# Altium project in3ator.PrjPcb
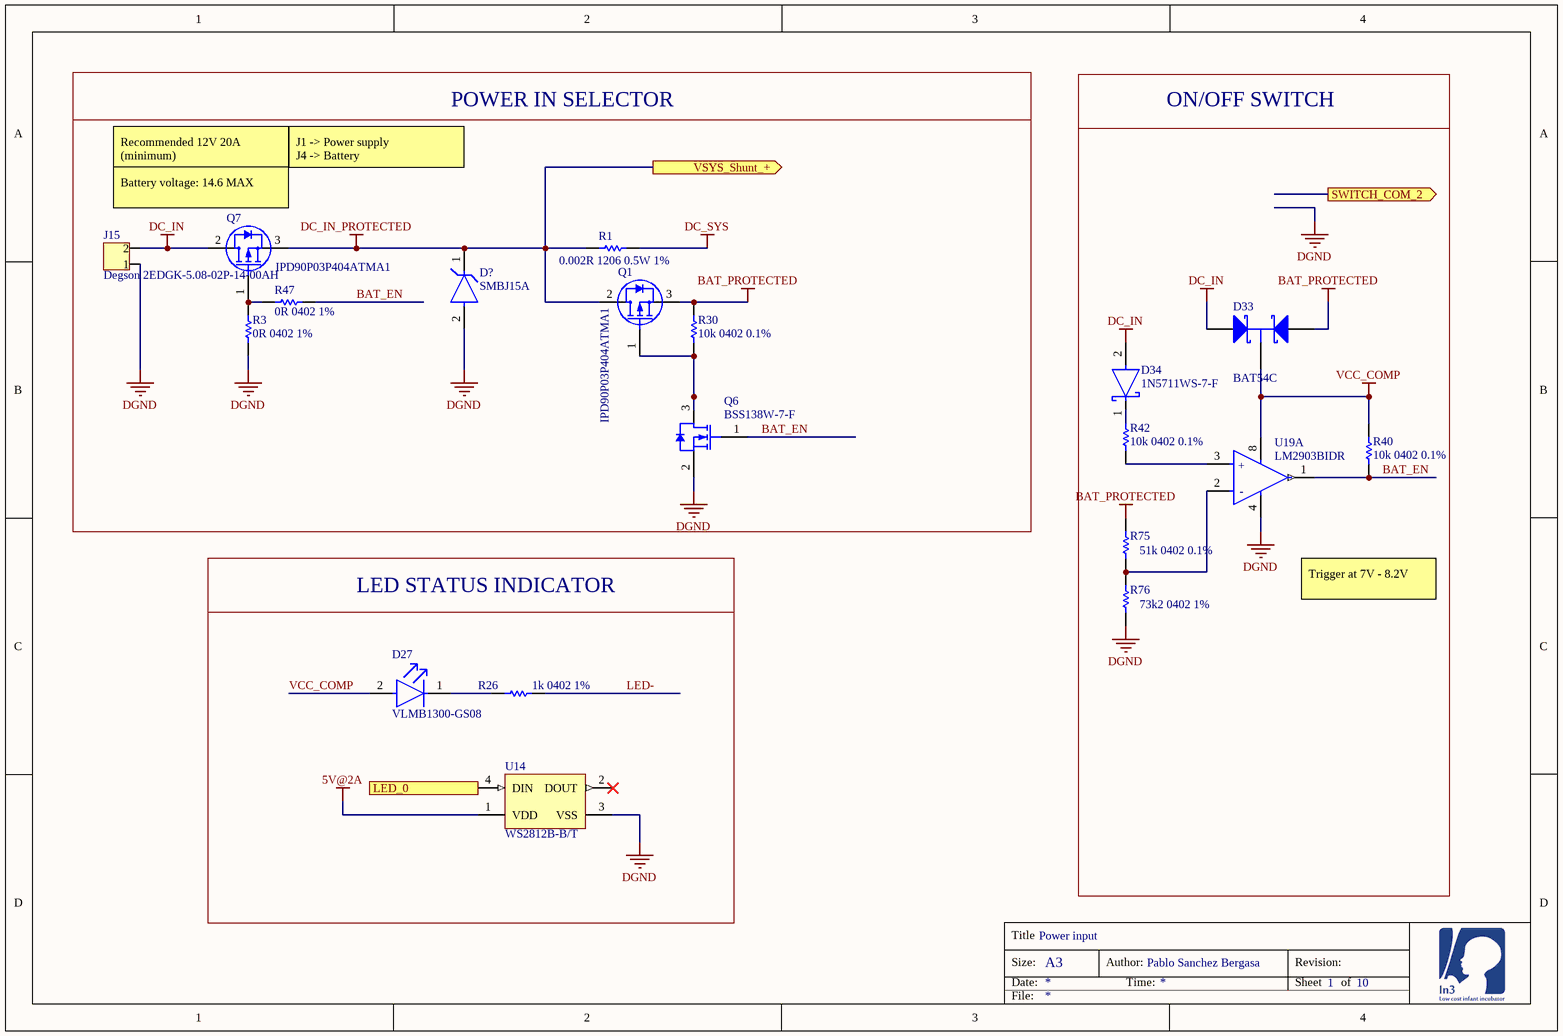
[diagram p0: Power_Input.SchDoc]
Author_in3: Pablo Sanchez Bergasa; SheetTotal_in3: 10
4 sheets, 92 parts. Net scope: flat (ports and power ports of the same name join across sheets).
Board file: Motherboard.PcbDoc
Sheets:
  Power_Input.SchDoc
  Battery.SchDoc
  Actuators.SchDoc
  Buzzer.SchDoc

## Sheet Power_Input.SchDoc: Power input
size A4; SheetNumber: 1; SheetTotal: 10

### Parts
D27  VLMB1300-GS08  [FP-6_541-5094_01-4-MFG]
D33  BAT54C  [NXP-SOT23-3_V]
D34  1N5711WS-7-F  [FP-SOD323-MFG]
D?  SMBJ15A  [FP-SMBJ-MFG]
J15  Degson 2EDGK-5.08-02P-14-00AH  [PCB-h4cyb3wxd4gf7j132tzl-1]
Q1  IPD90P03P404ATMA1  [DPAK IPD90P03P404ATMA1]
Q6  BSS138W-7-F  [DIOD-SOT323-3_V]
Q7  IPD90P03P404ATMA1  [DPAK IPD90P03P404ATMA1]
R1  0.002R 1206 0.5W 1%  [CAPC3216X180X55ML20T25]
R3  0R 0402 1%  [RESC1005X40X25ML05T10]
R26  1k 0402 1%  [RESC1005X40X25ML05T10]
R30  10k 0402 0.1%  [RESC1005X40X25ML05T10]
R40  10k 0402 0.1%  [RESC1005X40X25ML05T10]
R42  10k 0402 0.1%  [RESC1005X40X25ML05T10]
R47  0R 0402 1%  [RESC1005X40X25ML05T10]
R75  51k 0402 0.1%  [RESC1005X40X25ML05T10]
R76  73k2 0402 1%  [RESC1005X40X25ML05T10]
U14  WS2812B-B/T  [ADA-RGB-1655_V]
U19  LM2903BIDR  [FP-D0008A-MFG]  (part A of 2)

### Blocks framed on the sheet
POWER IN SELECTOR: D? J15 Q1 Q6 Q7 R1 R3 R30 R47
ON/OFF SWITCH: D33 D34 R40 R42 R75 R76 U19
LED STATUS INDICATOR: D27 R26 U14

### Ports
LED_0 (out), SWITCH_COM_2 (out), VSYS_Shunt_+ (out)

### Nets
5V@2A: U14.1(VDD)
BAT_PROTECTED: D33.2(A) Q1.3(S) R30.1 R75.2  [project net BAT_P]
DC_IN: D33.1(A) D34.2(A) J15.2 Q7.2(D)
DC_IN_PROTECTED: D?.1(C) Q1.2(D) Q7.3(S) R1.2 ; port VSYS_Shunt_+
DC_SYS: R1.1
DGND: D?.2(A) J15.1 Q6.2(S) R3.2 R76.1 U14.3(VSS) U19.4(GND)
VCC_COMP: D27.2(A) D33.3(K) R40.1 U19.8(VCC)
BAT_EN: Q6.1(G) R40.2 R47.2 U19.1(1OUT)
LED-: R26.1
NetD27_1: D27.1(C) R26.2
NetD34_1: D34.1(C) R42.2
NetQ1_1: Q1.1(G) Q6.3(D) R30.2
NetQ7_1: Q7.1(G) R3.1 R47.1
NetR42_1: R42.1 U19.3(1IN+)
NetR75_1: R75.1 R76.2 U19.2(1IN-)
NetU14_4: U14.4(DIN) ; port LED_0

Not connected (* = marked no-connect by the designer): U14 2(DOUT)*

### Notes on the sheet
- Recommended 12V 20A (minimum)
- J1 -> Power supply
  J4 -> Battery
- Battery voltage: 14.6 MAX
- Trigger at 7V - 8.2V
- Title
- Size:
- Date:
- A3
- Author:
- Time:
- Revision:
- Sheet
- of
- File:
- (in symbol CMP-04896-000007-1, part A) +; -

### Library data of the parts
D27 = CMP-02520-000013-1: LED BLUE 0603 SMD; Manufacturer: Vishay Semiconductor Opto Division; Forward Current: 20mA; Wavelength: 475nm; Viewing Angle: 130°; Forward Voltage: 3.8V; Power Dissipation: 76mW; Luminous Intensity: 28-180mcd; Led Orientation: Top View; Peak Emmision Wavelength: 468nm; RoHS: TRUE; ComponentLink2URL: http://www.vishay.com/docs/82437/vlmo1300.pdf; Ambient Temperature Range Low: -20°C; ComponentLink2Description: Datasheet; Mouser Description: LED; SMD; 0603; blue; 28-180mcd; 1.6x0.8x0.8mm; 130°; 2.8÷3.8V; 20mA; Manufacturer Part Number: VLMB1300-GS08; Package: 6.541-5094.01-4; Device Class L3: unset; Automotive: No; Temperature: -20°C to +80°C; Colour: Blue; Digikey Description: LED BLUE 0603 SMD; Device Class L2: LEDs; Temperature Range Low: -20°C; Lead Free: Yes; Category: Diode; Device Class L1: Optoelectronics; Height: 1mm; Octopart: https://octopart.com/vlmb1300-gs08-vishay-22022408; Temperature Range High: +80°C; Ambient Temperature Range High: +80°C; LCSC_PN: C435849
D33 = CMP-0417-00003-1: Schottky Barrier Diode, 30 V, 2 uA, -55 to 150 degC, 3-Pin SOT23, RoHS, Tape and Reel; Manufacturer: NXP Semiconductors; IR (uA): 2; VF (mV): 800; Trr (ns): 5; Cd (pF): 10; VR (V): 30; Rth(j-a) (K/W): 500; RoHS: TRUE; Packing: Tape and Reel; ComponentLink2URL: http://www.nxp.com/documents/data_sheet/BAT54_SER.pdf; PartNumber: BAT54C; ComponentLink2Description: Datasheet; Temperature Range: -55 to 150 degC; PackageReference: SOT23-3; PackageDescription: 3-Pin Plastic Surface-mounted Package, Body 1.3 x 2.9 mm, Pitch 0.95 mm; Mounting Technology: Surface Mount; ComponentLink1URL: http://www.nxp.com/; DatasheetVersion: Rev. 5; ComponentLink1Description: Manufacturer URL; LCSC_PN: C181200
D34 = CMP-12790-000032-1: DIODE SCHOTTKY 70V 150MW SOD323; Manufacturer: Diodes Inc; Value: 2pF; Standoff Height: 0.05mm; Max Junction Temp: +125°C; Forward Current: 15mA; Reverse Voltage: 49V; Category: Diode; Temperature: -55°C to +125°C; Digikey Description: DIODE SCHOTTKY 70V 150MW SOD323; Octopart: https://octopart.com/1n5711ws-7-f-diodes+inc.-323167; Manufacturer Part Number: 1N5711WS-7-F; Temperature Range High: +125°C; Lead Free: Yes; RoHS: TRUE; Device Class L2: Diodes; Height: 1.2mm; Automotive: No; Device Class L1: Discrete Semiconductors; Capacitance: 2pF; ComponentLink2URL: https://www.diodes.com/assets/Datasheets/ds31033.pdf; Temperature Range Low: -55°C; Max Repetitive Reverse Voltage: 70V; ComponentLink2Description: Datasheet; Package: SOD323; Device Class L3: Schottky Diodes; Mouser Description: Schottky Diodes & Rectifiers 70V 200mW; Footprint Url: https://www.diodes.com/assets/Package-Files/SOD323.pdf; LCSC_PN: C151442
D? = CMP-07401-000033-1: TVS DIODE 15VWM 24.4VC SMB; Max Breakdown Voltage: 19.2V; Reverse Standoff Voltage: 15V; Number of Elements: 1; Diode Type: ZENER; Max Reverse Leakage Current: 5uA; Operating Supply Voltage: 3.5V; Element Configuration: Single; Reverse Breakdown Voltage: 16.7V; Peak Pulse Power: 600W; Peak Pulse Current: 24A; Polarity: Unidirectional; Clamping Voltage: 24.4V; ESD Protection: Yes; Test Current: 1mA; Power Line Protection: No; Max Surge Current: 100A; Min Operating Temperature: -55°C; Number of Pins: 2; Case/Package: DO-214AA; Number of Channels: 1; Series: SMBJ; Height: 2.42mm; Resistor Type: Zener; Max Power Dissipation: 600W; REACH SVHC: No SVHC; Package Quantity: 1; Breakdown Voltage: 19.2V; Radiation Hardening: No; Direction: Unidirectional; Number of Unidirectional Channels: 1; Termination: SMD/SMT; Length: 4.57mm; Width: 3.94mm; Packaging: Tape and Reel; Leakage Current: 5uA; RoHS Compliant: Yes; Mount: Surface Mount; Min Breakdown Voltage: 16.7V; Max Operating Temperature: 150°C
J15 = CMP-7a42b7ee166ba585-1: Terminal block, 5mm 2 Pos, through hole male.; Manufacturer Part Number: 2EDGK-5.08-02P-14-00AH + 2EDGVC-5.08-02P; Octopart URL: https://octopart.com/2edgk-5.08-02p-14-00ah-degson-78006607; OctopartID: 7a42b7ee166ba585; Manufacturer Part Number 2: WJ2EDGVC-5.08-2P + WJ2EDGK-5.08-2P; LCSC Part: C8445; LCSC_PN: C8445
Q1 Q7 = CMP-3103264-6: Single P-Channel 30 V 4.5 mOhm 100 nC OptiMOS Power Mosfet - TO-252-3-11; Lead-Free Status: Lead Free; REACH SVHC Compliance: No SVHC; Octopart URL: https://octopart.com/ipd90p03p404atma1-infineon-21386769; Polarity: P-Channel; RoHS: Compliant; Mounting Style: Surface Mount; Operating Temperature: 175 °C (max); Packaging: Reel; Number of Pins: 3; OctopartID: f6ad3ee185da296a; Manufacturer Part Number: IPD90P03P404ATMA1; Manufacturer Part Number 2: WSF70P03; LCSC_PN: C148439
Q6 = CMP-2000-05968-1: N-Channel Enhancement Mode Mosfet, 50 V, 200 mA, -55 to 150 degC, 6-Pin SOT-323, RoHS, Tape and Reel; Typical Turn-Off Delay Time: 20ns; Number of Channels: 1Channel; Type: EnhancementModeFieldEffectTransistor; Brand: DiodesIncorporated; Vds - Drain-Source Breakdown Voltage: 75V; Vgs - Gate-Source Voltage: 20V; Rds On - Drain-Source Resistance: 1.4Ohms; Transistor Type: 1N-Channel; Configuration: Single; Unit Weight: 0.000212oz; Pd - Power Dissipation: 200mW; Id - Continuous Drain Current: 200mA; Forward Transconductance - Min: 0.1S; Manufacturer URL: http://www.diodes.com/; Series: BSS138; Package Description: 3-Pin Small Outline Transistor, Body 2 x 1.25 mm, Pitch 0.65 mm; Mounting Technology: SurfaceMount; Product Category: MOSFET; RoHS: True; Maximum Operating Temperature: +150C; Height: 1mm; Length: 2.2mm; Technology: Si; Width: 1.35mm; Datasheet URL: http://www.diodes.com/_files/datasheets/ds30206.pdf; Manufacturer: DiodesIncorporated; Package / Case: SOT-323-3; Typical Turn-On Delay Time: 20ns; Transistor Polarity: N-Channel; Factory Pack Quantity: 3000; Packaging: Reel; Product: MOSFETSmallSignal; Datasheet Version: Rev. 11-2, 09/2013; Package Reference: SOT323; Minimum Operating Temperature: -55C; Mounting Style: SMD/SMT; Channel Mode: Enhancement; LCSC_PN: C24553
R1 = CMP-0abdc173b10ad57a-1: Manufacturer Part Number: WSLP12065L000FEA; Resistance: 0,002; Power: 1W; Octopart URL: https://octopart.com/1-2176055-0-te+connectivity-46440145; Case/Package: 1206; Lifecycle Status: Not Listed by Manufacturer; Packaging: Tape & Reel (TR); OctopartID: 0abdc173b10ad57a; OrderingCode: WSLP12065L000FEA; Manufacturer Part Number 2: FMF06FTHR005-LHL; LCSC_PN: C601094
R3 R26 R30 R40 R42 R47 R75 = CMP-2002-07472-1
  R3 R47: LCSC_PN: C60485
  R26: LCSC_PN: C106235
  R30 R40 R42: LCSC_PN: C190095
  R75: LCSC_PN: C149896
R76 = CMP-2002-07472-1: Manufacturer: Yageo / Phycomp; LCSC_PN: C185398
U14 = CMP-2000-05026-1: Intelligent Control LED Integrated Light Source, 3.5 to 5.3 V, -25 to 80 degC, 4-Pin SMD, RoHS, Tape and Reel; Manufacturer: Adafruit-Industries-LLC; Number of LEDs: 10; Configuration: Discrete; Utilized LED: WS2812(5050); Datasheet URL: http://datasheet.octopart.com/ADA1655-Adafruit-Industries-datasheet-32028139.pdf; Series: Neopixel; Interface: -; Package Description: 4-Pin Surface Mount Device, Body 5 x 5 mm; Color: Red,Green,Blue(RGB); Category: Optoelectronics; Controller Type: -; Package Reference: 1655; Manufacturer URL: https://www.adafruit.com/; Mounting Type: SurfaceMount; Datasheet Version: May-13; Size / Dimension: 5.00mmLx5.00mmW; Family: Addressable,Specialty; LCSC_PN: C2761795
U19 = CMP-04896-000007-1: 36V JI.3 DUAL COMPARATOR; Manufacturer: Texas Instruments; Input Bias Current: -0.0035uA; Standoff Height: 0.11mm; Output Current Per Channel: 25mA; Response Time: 1us; Input Offset Voltage: 4mV; Number Of Channels: 2; Min Supply Voltage: 3V; Nominal Supply Current: 400-550uA; Max Junction Temp: +150°C; Max Supply Voltage: 36V; Height: 1.75mm; Ambient Temperature Range High: +125°C; Lead Free: Yes; Package: D0008A; Octopart: https://octopart.com/lm2903bidr-texas+instruments-104977165; Temperature Range High: +125°C; Device Class L1: Integrated Circuits (ICs); Ambient Temperature Range Low: -40°C; Temperature: -40°C to +125°C; Manufacturer Part Number: LM2903BIDR; Device Class L3: Comparators; Temperature Range Low: -40°C; Category: IC; ComponentLink2Description: Datasheet; ComponentLink2URL: http://www.ti.com/lit/ds/symlink/lm2903b.pdf; RoHS: TRUE; Device Class L2: Linear ICs; Digikey Description: 36V JI.3 DUAL COMPARATOR; Automotive: No; LCSC_PN: C2869804

## Sheet Battery.SchDoc: Power
size A3; SheetNumber: 2; SheetTotal: 10
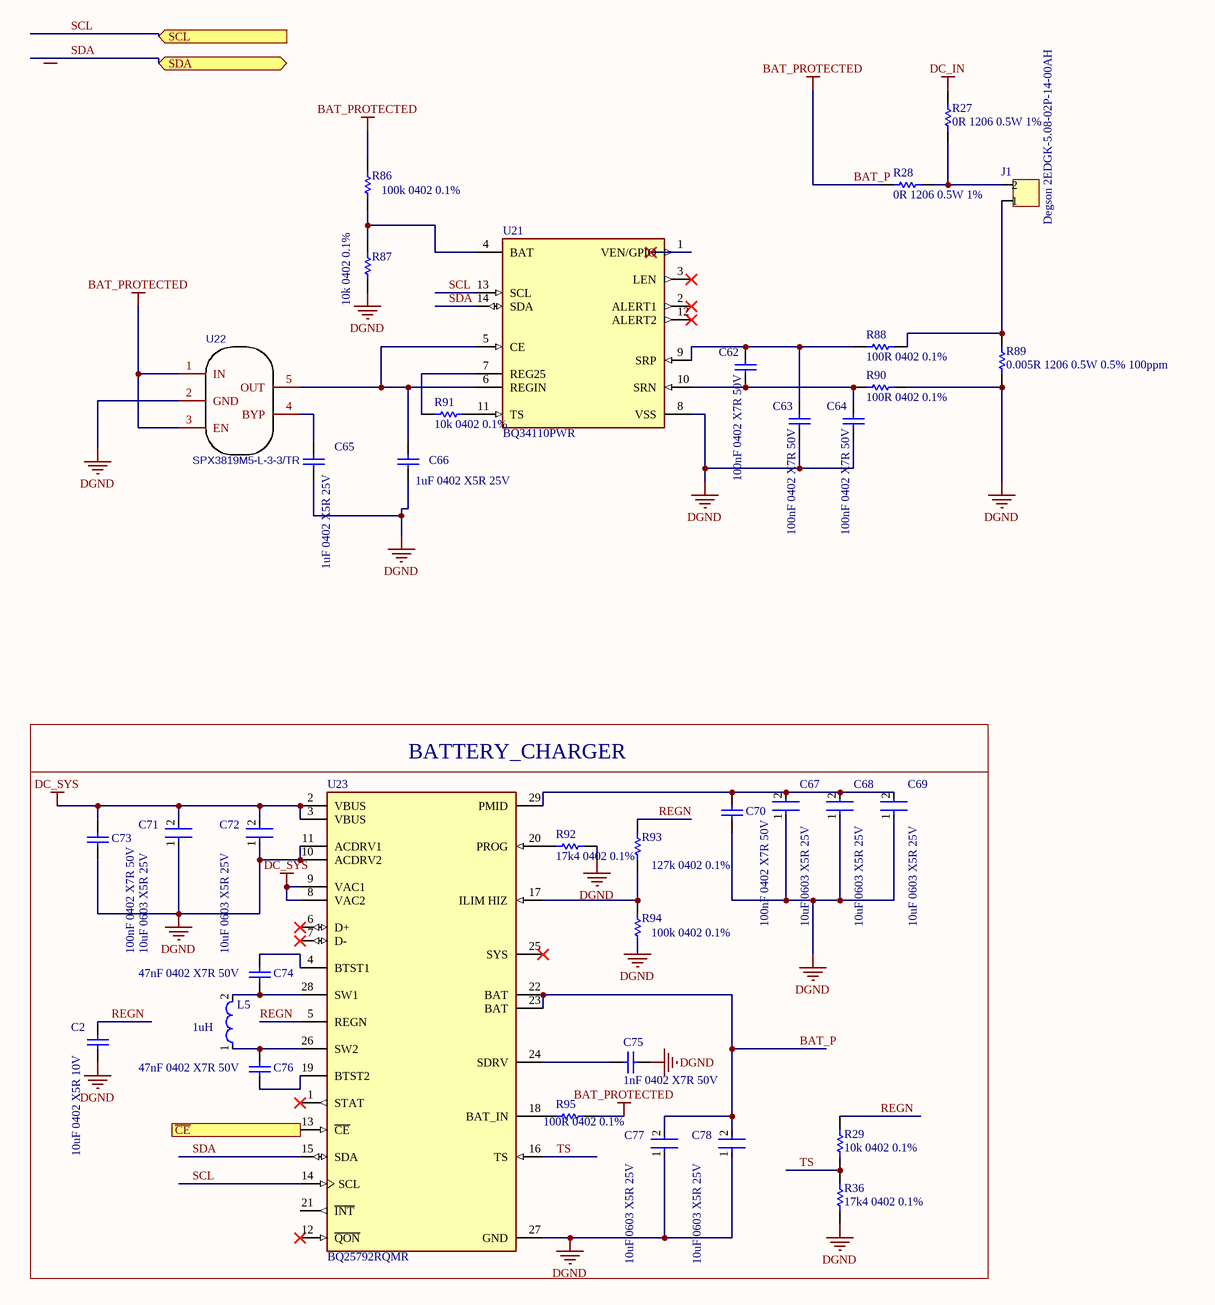
[diagram p1: Battery.SchDoc]

### Parts
C2  10uF 0402 X5R 10V  [CAPC1005X55X25NL5T10]
C62  100nF 0402 X7R 50V  [CAPC1005X55X25NL5T10]
C63  100nF 0402 X7R 50V  [CAPC1005X55X25NL5T10]
C64  100nF 0402 X7R 50V  [CAPC1005X55X25NL5T10]
C65  1uF 0402 X5R 25V  [CAPC1005X55X25NL5T10]
C66  1uF 0402 X5R 25V  [CAPC1005X55X25NL5T10]
C67  10uF 0603 X5R 25V  [FP-GRM188-0_2-IPC_B]
C68  10uF 0603 X5R 25V  [FP-GRM188-0_2-IPC_B]
C69  10uF 0603 X5R 25V  [FP-GRM188-0_2-IPC_B]
C70  100nF 0402 X7R 50V  [CAPC1005X55X25NL5T10]
C71  10uF 0603 X5R 25V  [FP-GRM188-0_2-IPC_B]
C72  10uF 0603 X5R 25V  [FP-GRM188-0_2-IPC_B]
C73  100nF 0402 X7R 50V  [CAPC1005X55X25NL5T10]
C74  47nF 0402 X7R 50V  [CAPC1005X55X25NL5T10]
C75  1nF 0402 X7R 50V  [CAPC1005X55X25NL5T10]
C76  47nF 0402 X7R 50V  [CAPC1005X55X25NL5T10]
C77  10uF 0603 X5R 25V  [FP-GRM188-0_2-IPC_B]
C78  10uF 0603 X5R 25V  [FP-GRM188-0_2-IPC_B]
J1  Degson 2EDGK-5.08-02P-14-00AH  [PCB-h4cyb3wxd4gf7j132tzl-1]
L5  Inductance: 1uH  [FP-DFE201612C-IPC_A]  (hidden comment: DFE201612E-1R0M=P2)
R27  0R 1206 0.5W 1%  [CAPC3216X180X55ML20T25]
R28  0R 1206 0.5W 1%  [CAPC3216X180X55ML20T25]
R29  10k 0402 0.1%  [RESC1005X40X25ML05T10]
R36  17k4 0402 0.1%  [RESC1005X40X25ML05T10]
R86  100k 0402 0.1%  [RESC1005X40X25ML05T10]
R87  10k 0402 0.1%  [RESC1005X40X25ML05T10]
R88  100R 0402 0.1%  [RESC1005X40X25ML05T10]
R89  0.005R 1206 0.5W 0.5% 100ppm  [CAPC3216X180X55ML20T25]
R90  100R 0402 0.1%  [RESC1005X40X25ML05T10]
R91  10k 0402 0.1%  [RESC1005X40X25ML05T10]
R92  17k4 0402 0.1%  [RESC1005X40X25ML05T10]
R93  127k 0402 0.1%  [RESC1005X40X25ML05T10]
R94  100k 0402 0.1%  [RESC1005X40X25ML05T10]
R95  100R 0402 0.1%  [RESC1005X40X25ML05T10]
U21  BQ34110PWR  [FP-PW0014A-MFG]
U22  SPX3819M5-L-3-3/TR  [SOT-23-5_L3.0-W1.7-P0.95-LS2.8-BR]
U23  BQ25792RQMR  [FP-RQM0029A-MFG]

### Blocks framed on the sheet
BATTERY_CHARGER: C2 C67-C78 L5 R29 R36 R92-R95 U23

### Ports
SCL (in), SDA (bidir), ~{CE} (in)

### Nets
BAT_P: C77.2 C78.2 R28.1 R86.2 R95.1 U22.1(IN) U22.3(EN) U23.22(BAT) U23.23(BAT)  [also labelled BAT_PROTECTED]
DC_IN: R27.1
DC_SYS: C71.2 C72.2 C73.2 U23.2(VBUS) U23.3(VBUS) U23.8(VAC2) U23.9(VAC1)
DGND: C2.1 C63.1 C64.1 C65.1 C66.1 C67.1 C68.1 C69.1 C70.1 C71.1 C72.1 C73.1 C75.1 C77.1 C78.1 R36.2 R87.1 R89.2 R90.1 R92.1 R94.1 U21.8(VSS) U22.2(GND) U23.10(ACDRV2) U23.11(ACDRV1) U23.27(GND)
REGN: C2.2 R29.1 R93.2 U23.5(REGN)
SCL: U21.13(SCL) U23.14(SCL) ; port SCL
SDA: U21.14(SDA) U23.15(SDA) ; port SDA
TS: R29.2 R36.1 U23.16(TS)
NetC62_1: C62.1 C64.2 R90.2 U21.10(SRN)
NetC62_2: C62.2 C63.2 R88.2 U21.9(SRP)
NetC65_2: C65.2 U22.4(BYP)
NetC66_2: C66.2 U21.5(CE) U21.6(REGIN) U22.5(OUT)
NetC67_2: C67.2 C68.2 C69.2 C70.2 U23.29(PMID)
NetC74_1: C74.1 L5.2 U23.28(SW1)
NetC74_2: C74.2 U23.4(BTST1)
NetC75_2: C75.2 U23.24(SDRV)
NetC76_1: C76.1 U23.19(BTST2)
NetC76_2: C76.2 L5.1 U23.26(SW2)
NetJ1_1: J1.1 R88.1 R89.1
NetJ1_2: J1.2 R27.2 R28.2
NetR86_1: R86.1 R87.2 U21.4(BAT)
NetR91_1: R91.1 U21.11(TS)
NetR91_2: R91.2 U21.7(REG25)
NetR92_2: R92.2 U23.20(PROG)
NetR93_1: R93.1 R94.2 U23.17(ILIM_HIZ)
NetR95_2: R95.2 U23.18(BAT_IN)
NetU23_13: U23.13(~{CE}) ; port ~{CE}

Not connected (* = marked no-connect by the designer): U21 1(VEN/GPIO)* 2(ALERT1)* 3(LEN)* 12(ALERT2)*; U23 1(STAT)* 6(D+)* 7(D-)* 12(~{QON})* 21(~{INT}) 25(SYS)*

### Notes on the sheet
- Title
- Size:
- Date:
- A3
- Author:
- Time:
- Revision:
- Sheet
- of
- File:

### Library data of the parts
C2 C62-C66 C70 C73-C76 = CMP-1662-00020-1: ComponentLink2Description: Datasheet; ComponentLink2URL: http://psearch.en.murata.com/capacitor/product/GRM155R60J105KE19%23.pdf; ComponentLink1Description: Manufacturer URL; ComponentLink1URL: http://www.murata.com/
  C2: LCSC_PN: C77000
  C62-C64 C70 C73: LCSC_PN: C77020
  C65 C66: LCSC_PN: C77009
  C74 C76: LCSC_PN: C272875
  C75: LCSC_PN: C106205
C67-C69 C71 C72 C77 C78 = CMP-06035-022879-1: LCSC_PN: C91606
J1 = CMP-7a42b7ee166ba585-1: as J15 on sheet Power_Input; Octopart URL: https://octopart.com/2edgk-5.08-02p-14-00ah-degson-78006607; OctopartID: 7a42b7ee166ba585; Manufacturer Part Number 2: WJ2EDGVC-5.08-2P + WJ2EDGK-5.08-2P; LCSC Part: C8445; LCSC_PN: C8445
L5 = CMP-06042-011635-1: Shielded Wirewound Inductor 1uH 20% 2900mA 0.048Ω 0806 (2016); LCSC_PN: C521238
R27 R28 = CMP-0abdc173b10ad57a-1: as R1 on sheet Power_Input; Octopart URL: https://octopart.com/1-2176055-0-te+connectivity-46440145; Case/Package: 1206; Lifecycle Status: Not Listed by Manufacturer; Packaging: Tape & Reel (TR); OctopartID: 0abdc173b10ad57a; OrderingCode: WSLP12065L000FEA; Manufacturer Part Number 2: FMF06FTHR005-LHL; LCSC_PN: C108081
R29 R36 R86-R88 R90-R95 = CMP-2002-07472-1
  R29 R87 R91: LCSC_PN: C190095
  R36 R92: LCSC_PN: C851231
  R86 R94: LCSC_PN: C60491
  R88 R90 R95: LCSC_PN: C106233
  R93: LCSC_PN: C138061
R89 = CMP-0abdc173b10ad57a-1: 0.002R 1206 0.5W 1%; Manufacturer Part Number: WSLP12065L000FEA; Resistance: 0,005; Power: 1W; Octopart URL: https://octopart.com/1-2176055-0-te+connectivity-46440145; Case/Package: 1206; Lifecycle Status: Not Listed by Manufacturer; Packaging: Tape & Reel (TR); OctopartID: 0abdc173b10ad57a; OrderingCode: WSLP12065L000FEA; Manufacturer Part Number 2: FMF06FTHR005-LHL; LCSC_PN: C723507
U21 = CMP-04911-000003-1: IC BATT MON MULTICELL 14TSSOP; Manufacturer: Texas Instruments; Number Of Outputs: 2; Max Junction Temp: +100°C; Max Supply Voltage: 4.5V; Min Supply Voltage: 2.45V; Number Of Cells: 4; Standoff Height: 0.05mm; Nominal Supply Current: 133uA; Package: PW0014A; Temperature Range High: +85°C; Octopart: https://octopart.com/bq34110pwr-texas+instruments-75529711; ComponentLink2URL: https://www.ti.com/lit/ds/symlink/bq34110.pdf; Device Class L1: Integrated Circuits (ICs); Height: 1.2mm; Device Class L3: Battery Management; Temperature Range Low: -40°C; RoHS: TRUE; Digikey Description: IC BATT MON MULTICELL 14TSSOP; Device Class L2: Power Management ICs; Manufacturer Part Number: BQ34110PWR; Lead Free: Yes; ComponentLink2Description: Datasheet; Category: IC; Automotive: No; Mouser Description: Multi-Chemistry High-Cell Count Battery Fuel Gauge With Integrated Rarely Discharged Module 14-TSSOP -40 to 85; Temperature: -40°C to +85°C; Ambient Temperature Range Low: -40°C; Ambient Temperature Range High: +85°C; LCSC_PN: C2877075
U22 = SPX3819M5-L-3-3/TR: BOM_Manufacturer: EXAR; BOM_Supplier: LCSC; BOM_Manufacturer Part: SPX3819M5-L-3-3/TR; BOM_Supplier Part: C9055; BOM_JLCPCB Part Class: Extended Part; spicePre: U; spiceSymbolName: SPX3819M5-L-3-3/TR; LCSC_PN: C9055
U23 = CMP-04911-000031-1: I2C CONTROLLED, 5-A, 1-4 CELL BU; RoHS Compliant: Yes; LCSC_PN: C2862876

## Sheet Actuators.SchDoc: Actuators
size A3; SheetNumber: 5; SheetTotal: 10
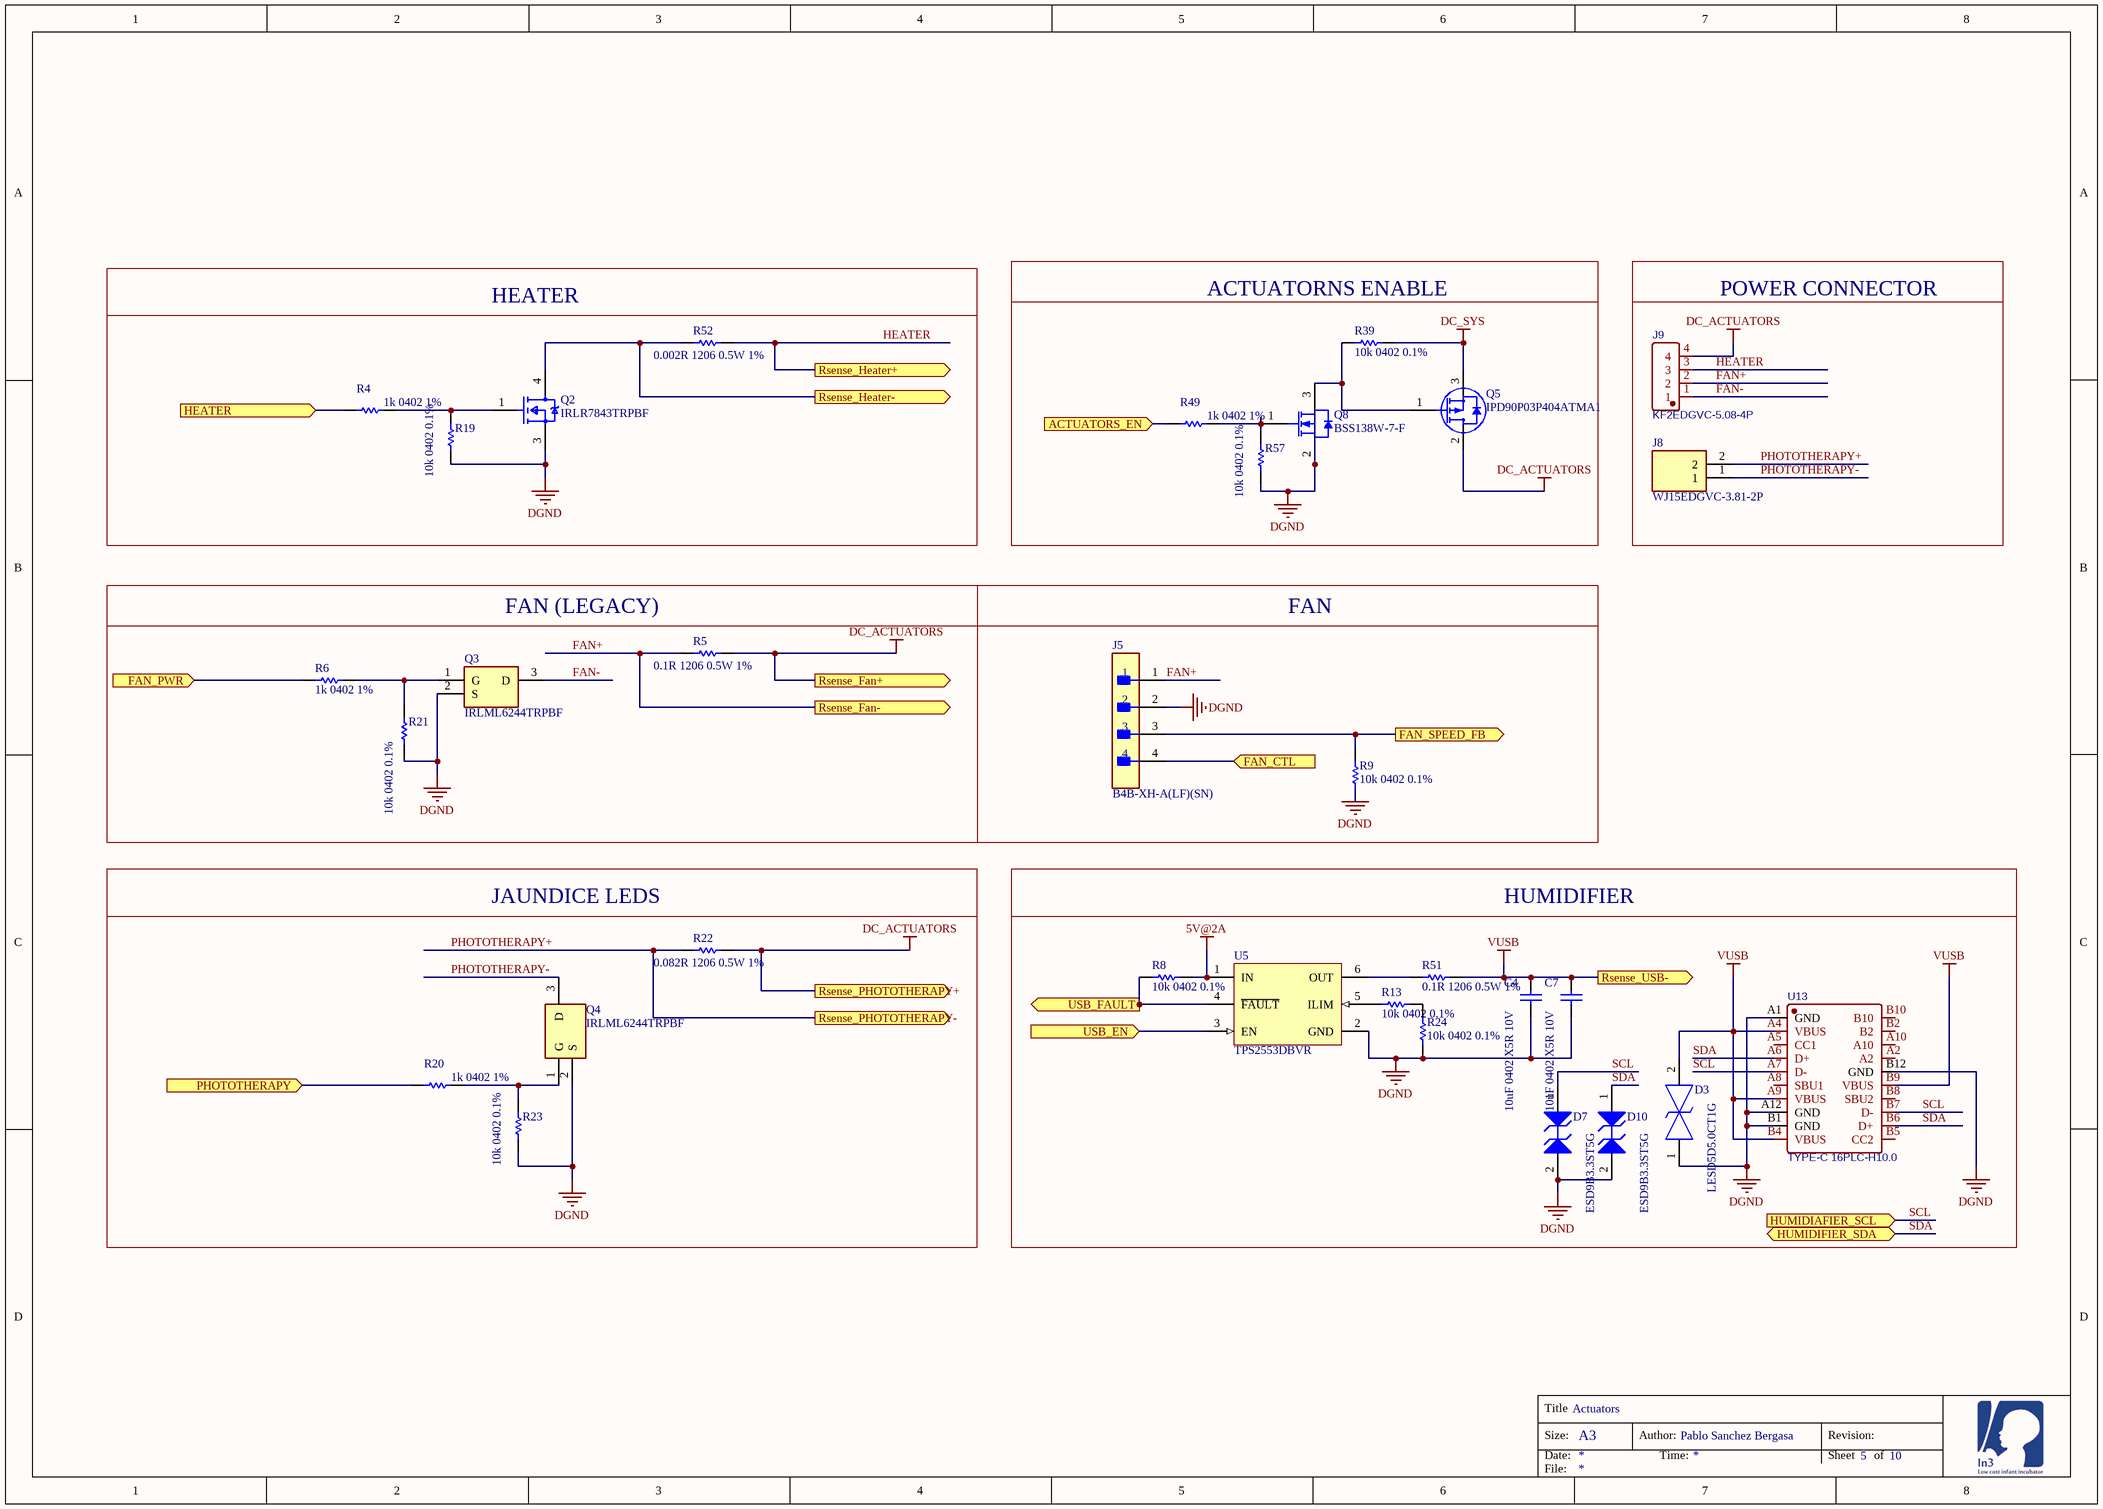
[diagram p2: Actuators.SchDoc]

### Parts
C4  10uF 0402 X5R 10V  [CAPC1005X55X25NL5T10]
C7  10uF 0402 X5R 10V  [CAPC1005X55X25NL5T10]
D3  LESD5D5.0CT1G  [LESD5D50CT1G]
D7  ESD9B3.3ST5G  [ONSC-SOD-923-2-514AB-01_V]
D10  ESD9B3.3ST5G  [ONSC-SOD-923-2-514AB-01_V]
J5  B4B-XH-A(LF)(SN)  [FP-B4B-XH-A_LF_SN-MFG]
J8  WJ15EDGVC-3.81-2P  [SHDR2W85P0X381_1X2_850X700X935P]
J9  KF2EDGVC-5.08-4P  [CONN-TH_4P-P5.08_KF2EDGVC-5.08-4P]
Q2  IRLR7843TRPBF  [FP-PG-TO252-3-MFG]
Q3  IRLML6244TRPBF  [SOT95P237X112-3N]
Q4  IRLML6244TRPBF  [SOT95P237X112-3N]
Q5  IPD90P03P404ATMA1  [DPAK IPD90P03P404ATMA1]
Q8  BSS138W-7-F  [DIOD-SOT323-3_V]
R4  1k 0402 1%  [RESC1005X40X25ML05T10]
R5  0.1R 1206 0.5W 1%  [CAPC3216X180X55ML20T25]
R6  1k 0402 1%  [RESC1005X40X25ML05T10]
R8  10k 0402 0.1%  [RESC1005X40X25ML05T10]
R9  10k 0402 0.1%  [RESC1005X40X25ML05T10]
R13  10k 0402 0.1%  [RESC1005X40X25ML05T10]
R19  10k 0402 0.1%  [RESC1005X40X25ML05T10]
R20  1k 0402 1%  [RESC1005X40X25ML05T10]
R21  10k 0402 0.1%  [RESC1005X40X25ML05T10]
R22  0.082R 1206 0.5W 1%  [CAPC3216X180X55ML20T25]
R23  10k 0402 0.1%  [RESC1005X40X25ML05T10]
R24  10k 0402 0.1%  [RESC1005X40X25ML05T10]
R39  10k 0402 0.1%  [RESC1005X40X25ML05T10]
R49  1k 0402 1%  [RESC1005X40X25ML05T10]
R51  0.1R 1206 0.5W 1%  [CAPC3216X180X55ML20T25]
R52  0.002R 1206 0.5W 1%  [CAPC3216X180X55ML20T25]
R57  10k 0402 0.1%  [RESC1005X40X25ML05T10]
U5  TPS2553DBVR  [DBV0006A_M]
U13  TYPE-C 16PLC-H10.0  [TYPE-C-TH_16PLC-H10.0]

### Blocks framed on the sheet
HEATER: Q2 R4 R19 R52
ACTUATORNS ENABLE: Q5 Q8 R39 R49 R57
POWER CONNECTOR: J8 J9
FAN: J5 R9
FAN (LEGACY): Q3 R5 R6 R21
JAUNDICE LEDS: Q4 R20 R22 R23
HUMIDIFIER: C4 C7 D3 D7 D10 R8 R13 R24 R51 U5 U13

### Ports
ACTUATORS_EN (in), FAN_CTL (in), FAN_PWR (in), FAN_SPEED_FB (out), HEATER (in), HUMIDIAFIER_SCL (in), HUMIDIFIER_SDA (bidir), PHOTOTHERAPY (in), Rsense_Fan+ (out), Rsense_Fan- (out), Rsense_Heater+ (out), Rsense_Heater- (out), Rsense_PHOTOTHERAPY+ (out), Rsense_PHOTOTHERAPY- (out), Rsense_USB- (out), USB_EN (in), USB_FAULT (out)

### Nets
5V@2A: R8.2 U5.1(IN)
DC_ACTUATORS: J9.4 Q5.2(D) R5.1 R22.1 ; port Rsense_PHOTOTHERAPY+, port Rsense_Fan+
DC_SYS: Q5.3(S) R39.1
DGND: C4.1 C7.1 D3.1 D7.2(A2) D10.2(A2) J5.2 Q2.3(SOURCE) Q3.2(S) Q4.2(S) Q8.2(S) R9.1 R19.1 R21.1 R23.1 R24.1 R57.1 U5.2(GND) U13.A1(GND) U13.A12(GND) U13.B1(GND) U13.B12(GND)
VUSB: C4.2 C7.2 D3.2 R51.2 U13.A4(VBUS) U13.A9(VBUS) U13.B4(VBUS) U13.B9(VBUS) ; port Rsense_USB-
FAN+: J5.1 J9.2 R5.2 ; port Rsense_Fan-
FAN-: J9.1 Q3.3(D)
HEATER: J9.3 R52.1 ; port Rsense_Heater+
PHOTOTHERAPY+: J8.2 R22.2 ; port Rsense_PHOTOTHERAPY-
PHOTOTHERAPY-: J8.1 Q4.3(D)
SCL: D7.1(A1) U13.A7(D-) U13.B7(D-) ; port HUMIDIAFIER_SCL
SDA: D10.1(A1) U13.A6(D+) U13.B6(D+) ; port HUMIDIFIER_SDA
NetJ5_3: J5.3 R9.2 ; port FAN_SPEED_FB
NetJ5_4: J5.4 ; port FAN_CTL
NetQ2_1: Q2.1(GATE) R4.1 R19.2
NetQ2_4: Q2.4(DRAIN) R52.2 ; port Rsense_Heater-
NetQ3_1: Q3.1(G) R6.1 R21.2
NetQ4_1: Q4.1(G) R20.1 R23.2
NetQ5_1: Q5.1(G) Q8.3(D) R39.2
NetQ8_1: Q8.1(G) R49.1 R57.2
NetR4_2: R4.2 ; port HEATER
NetR6_2: R6.2 ; port FAN_PWR
NetR8_1: R8.1 U5.4(~{FAULT}) ; port USB_FAULT
NetR13_1: R13.1 R24.2
NetR13_2: R13.2 U5.5(ILIM)
NetR20_2: R20.2 ; port PHOTOTHERAPY
NetR49_2: R49.2 ; port ACTUATORS_EN
NetR51_1: R51.1 U5.6(OUT)
NetU5_3: U5.3(EN) ; port USB_EN

Not connected (* = marked no-connect by the designer): U13 A2 A5(CC1) A8(SBU1) A10 B2 B5(CC2) B8(SBU2) B10

### Notes on the sheet
- Title
- Size:
- Date:
- A3
- Author:
- Time:
- Revision:
- Sheet
- of
- File:

### Library data of the parts
C4 C7 = CMP-1662-00020-1: ComponentLink2Description: Datasheet; ComponentLink2URL: http://psearch.en.murata.com/capacitor/product/GRM155R60J105KE19%23.pdf; ComponentLink1Description: Manufacturer URL; ComponentLink1URL: http://www.murata.com/; LCSC_PN: C77000
D3 = LESD5D5.0CT1G: TVS Diode (Bi-directional); Manufacturer_Name: LRC; Height: 0.7mm; Manufacturer_Part_Number: LESD5D5.0CT1G; LCSC_PN: C383211
D7 D10 = CMP-1063-00120-1: Transient Voltage Suppressor, Micro-Packaged Diode for ESD Protection, 2-Pin SOD-923, Pb-Free, Tape and Reel; Manufacturer: On Semiconductor; Number of Lines: 1; V(BR) Min (V): 5; VRWM Max (V): 3.3; Direction: Bidirectional; ComponentLink3URL: http://www.onsemi.com/pub_link/Collateral/514AB.PDF; PartNumber: ESD9B3.3ST5G; PackageVersion: Rev. C, 03/2011; Mounting Technology: Surface Mount; PackageReference: SOD-923-2-514AB-01; RoHS: Pb-Free; DatasheetVersion: Rev. 2; ComponentLink1URL: http://www.onsemi.com/; PackageDescription: 2-Pin SOD, Body 0.8 x 0.6 mm; ComponentLink3Description: Package Specification; ComponentLink2URL: http://www.onsemi.cn/pub_link/Collateral/ESD9B-D.PDF; IR Max (uA): 1; Packing: Tape and Reel; ComponentLink2Description: Datasheet; ComponentLink1Description: Manufacturer URL; LCSC_PN: C96512
J5 = CMP-17439-000250-1: CONN HEADER VERT 4POS 2.5MM; Number of Contacts: 4; Contact Resistance: 20mR; Voltage Rating: 250V; Max Current Rating: 3A; Gender: Male; Wire/Cable Gauge: 22AWG; Mated Stacking Heights: 9.8mm; Insulation Resistance: 1GR; Orientation: Straight; Contact Type: Male Pin; Contact Finish - Mating: TIN; Series: XH; Max Voltage Rating (AC): 250V; Lead Pitch: 2.5mm; Contact Shape: Square; Insulation Color: Natural; Termination: Solder; Lead Free: Lead Free; Voltage Rating (AC): 250V; Number of Rows: 1; Flammability Rating: UL94 V-0; Number of Positions: 4; Max Operating Temperature: 85°C; Package Quantity: 500; Mount: Through Hole; REACH SVHC: No SVHC; Connector Type: Header; Insulation Material: Nylon; Fastening Type: Detent; Min Operating Temperature: -25°C; Housing Color: White; Packaging: Bulk; Contact Plating: Tin; Contact Material: Brass; Max Voltage Rating (DC): 250V; Housing Material: Polyamide; Color: Natural; Material: Polyamide; Pitch: 2.5mm; Depth: 5.75mm; Current Rating: 3A; Length: 12.4mm; LCSC_PN: C144395
J8 = WJ15EDGVC-3.81-2P: Connector; Manufacturer_Name: Ningbo Kangnex; Datasheet Link: https://datasheet.lcsc.com/szlcsc/Ningbo-Kangnex-Elec-WJ15EDGVC-3-81-2P_C8396.pdf; Height: 9.35mm; Manufacturer_Part_Number: WJ15EDGVC-3.81-2P; LCSC_PN: C8396
J9 = KF2EDGVC-5.08-4P: BOM_Manufacturer: Cixi Kefa Elec; Contributor: LCSC; BOM_Supplier: LCSC; BOM_Supplier Part: C441388; BOM_Manufacturer Part: KF2EDGVC-5.08-4P; BOM_JLCPCB Part Class: Extended Part; spicePre: C; spiceSymbolName: KF2EDGVC-5.08-4P; LCSC_PN: C441388
Q2 = CMP-32901-000143-1: MOSFET N-CH 30V 161A DPAK; Manufacturer: Infineon; Drain To Source Resistance: 3.2mΩ; Depletion Mode: False; Reverse Recovery Time: 39ns; Reverse Recovery Charge: 36nC; Threshold Vgs Max: 2.3V; Rthja Max: 50°C/W; Threshold Vgs Min: 1.4V; Power Dissipation: 140W; Pulse Drain Current: 620A; Input Capacitace At Vds: 4380pF @ 15V; Turn On Delay Time: 25ns; Gate To Source Voltage: 20V; Max Forward Diode Voltage: 1V; Gate Charge At Vgs: 34nC @ 4.5V; Max Junction Temp: +175°C; Number Of Channels: 1; Turn Off Delay Time: 34ns; ComponentLink2URL: https://www.infineon.com/dgdl/irlr7843pbf.pdf?fileId=5546d462533600a40153566de53526d8; Temperature Range High: +175°C; Octopart: https://octopart.com/irlr7843trpbf-infineon-65875062; Temperature: -55°C to +175°C; Device Class L3: MOSFETs; Manufacturer Part Number: IRLR7843TRPBF; Category: Trans; Package: PG-TO252-3; Footprint Url: https://www.infineon.com/cms/en/product/packages/PG-TO252/PG-TO252-3-901/; Continuous Drain Current: 161A; Digikey Description: MOSFET N-CH 30V 161A DPAK; Automotive: No; Lead Free: Yes; Drain To Source Breakdown Voltage: 30V; Height: 2.52mm; Temperature Range Low: -55°C; RoHS: TRUE; Number Of N Channels: 1; Drain To Source Voltage: 30V; ComponentLink2Description: Datasheet; Device Class L2: Transistors; Device Class L1: Discrete Semiconductors; LCSC_PN: C21988
Q3 Q4 = IRLML6244TRPBF: Transistor; Manufacturer_Name: Infineon; Datasheet Link: http://www.infineon.com/dgdl/irlml6244pbf.pdf?fileId=5546d462533600a4015356686fed261f; Height: 1.12mm; Manufacturer_Part_Number: IRLML6244TRPBF; Mouser Part Number: 942-IRLML6244TRPBF; Mouser Price/Stock: https://www.mouser.co.uk/ProductDetail/Infineon-IR/IRLML6244TRPBF?qs=9%252BKlkBgLFf1HkY%2F2U%252BIhLQ%3D%3D; Arrow Part Number: IRLML6244TRPBF; Arrow Price/Stock: https://www.arrow.com/en/products/irlml6244trpbf/infineon-technologies-ag?region=nac; LCSC_PN: C143946
Q5 = CMP-3103264-6: as Q1 on sheet Power_Input; REACH SVHC Compliance: No SVHC; Octopart URL: https://octopart.com/ipd90p03p404atma1-infineon-21386769; Polarity: P-Channel; RoHS: Compliant; Mounting Style: Surface Mount; Operating Temperature: 175 °C (max); Packaging: Reel; Number of Pins: 3; OctopartID: f6ad3ee185da296a; Manufacturer Part Number: IPD90P03P404ATMA1; Manufacturer Part Number 2: WSF70P03; LCSC_PN: C148439
Q8 = CMP-2000-05968-1: as Q6 on sheet Power_Input; Manufacturer URL: http://www.diodes.com/; Series: BSS138; Package Description: 3-Pin Small Outline Transistor, Body 2 x 1.25 mm, Pitch 0.65 mm; Mounting Technology: SurfaceMount; Product Category: MOSFET; RoHS: True; Maximum Operating Temperature: +150C; Height: 1mm; Length: 2.2mm; Technology: Si; Width: 1.35mm; Datasheet URL: http://www.diodes.com/_files/datasheets/ds30206.pdf; Manufacturer: DiodesIncorporated; Package / Case: SOT-323-3; Typical Turn-On Delay Time: 20ns; Transistor Polarity: N-Channel; Factory Pack Quantity: 3000; Packaging: Reel; Product: MOSFETSmallSignal; Datasheet Version: Rev. 11-2, 09/2013; Package Reference: SOT323; Minimum Operating Temperature: -55C; Mounting Style: SMD/SMT; Channel Mode: Enhancement; LCSC_PN: C24553
R4 R6 R8 R9 R13 R19-R21 R23 R24 R39 R49 R57 = CMP-2002-07472-1
  R4 R6 R20 R49: LCSC_PN: C106235
  R8 R9 R13 R19 R21 R23 R24 R39 R57: LCSC_PN: C190095
R5 R22 R51 = CMP-0abdc173b10ad57a-1: Manufacturer Part Number: WSLP12065L000FEA; Resistance: 0,1; Power: 1W; Octopart URL: https://octopart.com/1-2176055-0-te+connectivity-46440145; Case/Package: 1206; Lifecycle Status: Not Listed by Manufacturer; Packaging: Tape & Reel (TR); OctopartID: 0abdc173b10ad57a
  R5 R51: LCSC_PN: C601090
  R22: LCSC_PN: C705560
R52 = CMP-0abdc173b10ad57a-1: as R1 on sheet Power_Input; Octopart URL: https://octopart.com/1-2176055-0-te+connectivity-46440145; Case/Package: 1206; Lifecycle Status: Not Listed by Manufacturer; Packaging: Tape & Reel (TR); OctopartID: 0abdc173b10ad57a; OrderingCode: WSLP12065L000FEA; Manufacturer Part Number 2: FMF06FTHR005-LHL; LCSC_PN: C601094
U5 = CMP-0337-00284-2: Adjustable, Active High, Constant-Current, Current-Limited Power-Distribution Switch, 0.075 to 1.7 A Current Limit, -40 to 85 degC, 6-pin SOT-23 (DBV), Green (RoHS & no Sb/Br); Manufacturer: Texas Instruments; Continuous Current(Max)(A): 1.5; Vin(Min)(V): 2.5; Current Limit Accuracy @ 1A: +/-7.5% (925mA min / 1075mA max); Vin(Max)(V): 6.5; Rating: Catalog; rDS(on) per FET(Typ)(mOhms): 100/DRV, 85/DBV; Number of Switches: 1; ComponentLink1Description: Datasheet; PartNumber: TPS2553DBVR; Enable: Active High; PackageDescription: 6-Pin Plastic Small-Outline Package, 2.9 x 1.6 mm Body, 0.95 mm Pitch, 2.8 mm Lead Span; DatasheetVersion: SLVS841E; Code_JEDEC: MO-178-AB*; Current Limit Topology: Constant-Current; Mounting Technology: Surface Mount; Eco-Plan: Green (RoHS & no Sb/Br); PackageVersion: revK, Mar-2006; PackageReference: DBV0006A; ComponentLink1URL: http://www.ti.com/general/docs/lit/getliterature.tsp?genericPartNumber=TPS2553&fileType=pdf; Current Limit(A): 0.075 to 1.7; LCSC_PN: C55266
U13 = TYPE-C 16PLC-H10.0: Manufacturer: SHOU HAN(首韩); Contributor: lcsc; Supplier: LCSC; Supplier Part: C3151747; Manufacturer Part: TYPE-C 16PLC-H10.0; JLCPCB Part Class: Extended Part; spicePre: U; spiceSymbolName: TYPE-C 16PLC-H10.0; LCSC_PN: C3151747

## Sheet Buzzer.SchDoc: Buzzer
size A4; SheetNumber: 7; SheetTotal: 9
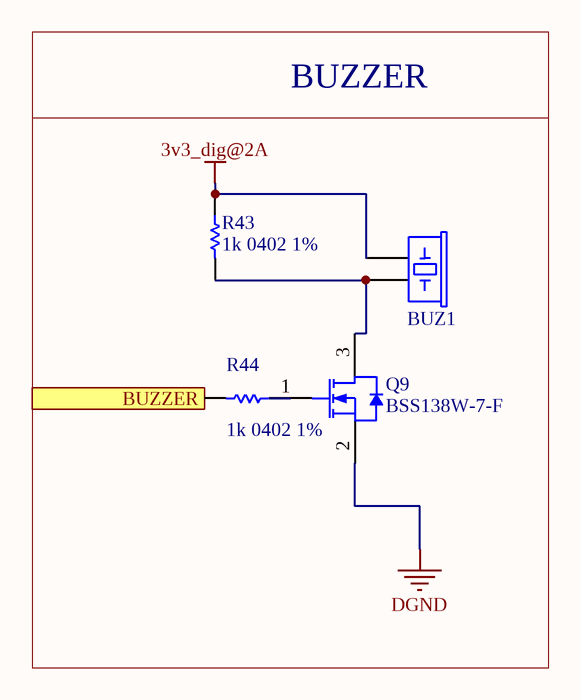
[diagram p3: Buzzer.SchDoc]

### Parts
BUZ1  CUI CMT-1285C-035  [BUZZER-12MM-NS]  (value not drawn)
Q9  BSS138W-7-F  [DIOD-SOT323-3_V]
R43  1k 0402 1%  [RESC1005X40X25ML05T10]
R44  1k 0402 1%  [RESC1005X40X25ML05T10]

### Blocks framed on the sheet
BUZZER: BUZ1 Q9 R43 R44

### Ports
BUZZER (in)

### Nets
3v3_dig@2A: BUZ1.1(+) R43.1
DGND: Q9.2(S)
NetBUZ1_2: BUZ1.2(-) Q9.3(D) R43.2
NetQ9_1: Q9.1(G) R44.1
NetR44_2: R44.2 ; port BUZZER

### Notes on the sheet
- Title
- Size:
- Date:
- A3
- Author:
- Time:
- Revision:
- Sheet
- of
- File:

### Library data of the parts
BUZ1 = CMP-581a9557be5887dd-1: Audio Buzzer Magnetic 3Vo-p 5Vo-p 70mA 3.5Vo-p 85dB Through Hole Pin Tray; Lead-Free Status: Lead Free; Octopart URL: https://octopart.com/cmt-1285c-035-cui-71811876; Manufacturer Part Number: CMT-1285C-035; Mounting Style: Through Hole; RoHS: Compliant; OctopartID: 581a9557be5887dd; Manufacturer Part Number 2: GMC1205YA-16R2048; LCSC_PN: C252915
Q9 = CMP-2000-05968-1: as Q6 on sheet Power_Input; Manufacturer URL: http://www.diodes.com/; Series: BSS138; Package Description: 3-Pin Small Outline Transistor, Body 2 x 1.25 mm, Pitch 0.65 mm; Mounting Technology: SurfaceMount; Product Category: MOSFET; RoHS: True; Maximum Operating Temperature: +150C; Height: 1mm; Length: 2.2mm; Technology: Si; Width: 1.35mm; Datasheet URL: http://www.diodes.com/_files/datasheets/ds30206.pdf; Manufacturer: DiodesIncorporated; Package / Case: SOT-323-3; Typical Turn-On Delay Time: 20ns; Transistor Polarity: N-Channel; Factory Pack Quantity: 3000; Packaging: Reel; Product: MOSFETSmallSignal; Datasheet Version: Rev. 11-2, 09/2013; Package Reference: SOT323; Minimum Operating Temperature: -55C; Mounting Style: SMD/SMT; Channel Mode: Enhancement; LCSC_PN: C24553
R43 R44 = CMP-2002-07472-1: LCSC_PN: C106235

## Nets that join several sheets
5V@2A: Power_Input (U14.1), Actuators (R8.2 U5.1)
BAT_P: Power_Input (D33.2 Q1.3 R30.1 R75.2), Battery (9 pins)
DC_IN: Power_Input (D33.1 D34.2 J15.2 Q7.2), Battery (R27.1)
DC_SYS: Power_Input (R1.1), Battery (7 pins), Actuators (Q5.3 R39.1)
DGND: Power_Input (7 pins), Battery (26 pins), Actuators (21 pins), Buzzer (Q9.2)

## Assembly variants
Main: not fitted C9 C10 C13 C33 C51 D8 J2 J5 J? L1 L2 L3 R3 R3 R7 R8 R9 R41 R48 R56 R58 R61 R63 R71 R? R? R? R? R? SW1 U8 U12 U13
NO_AFE: not fitted C9 C10 C13 C33 C54 C55 C56 C57 C58 C59 C60 C61 D28 D29 D31 D32 J14 R3 R58 R59 R60 R61 R62 R65 R66 R67 R68 R69 R71 R79 U17 Y1